# EAGLE design Display-Board_Rack-PDU_3.0 (EAGLE 9.6.2)
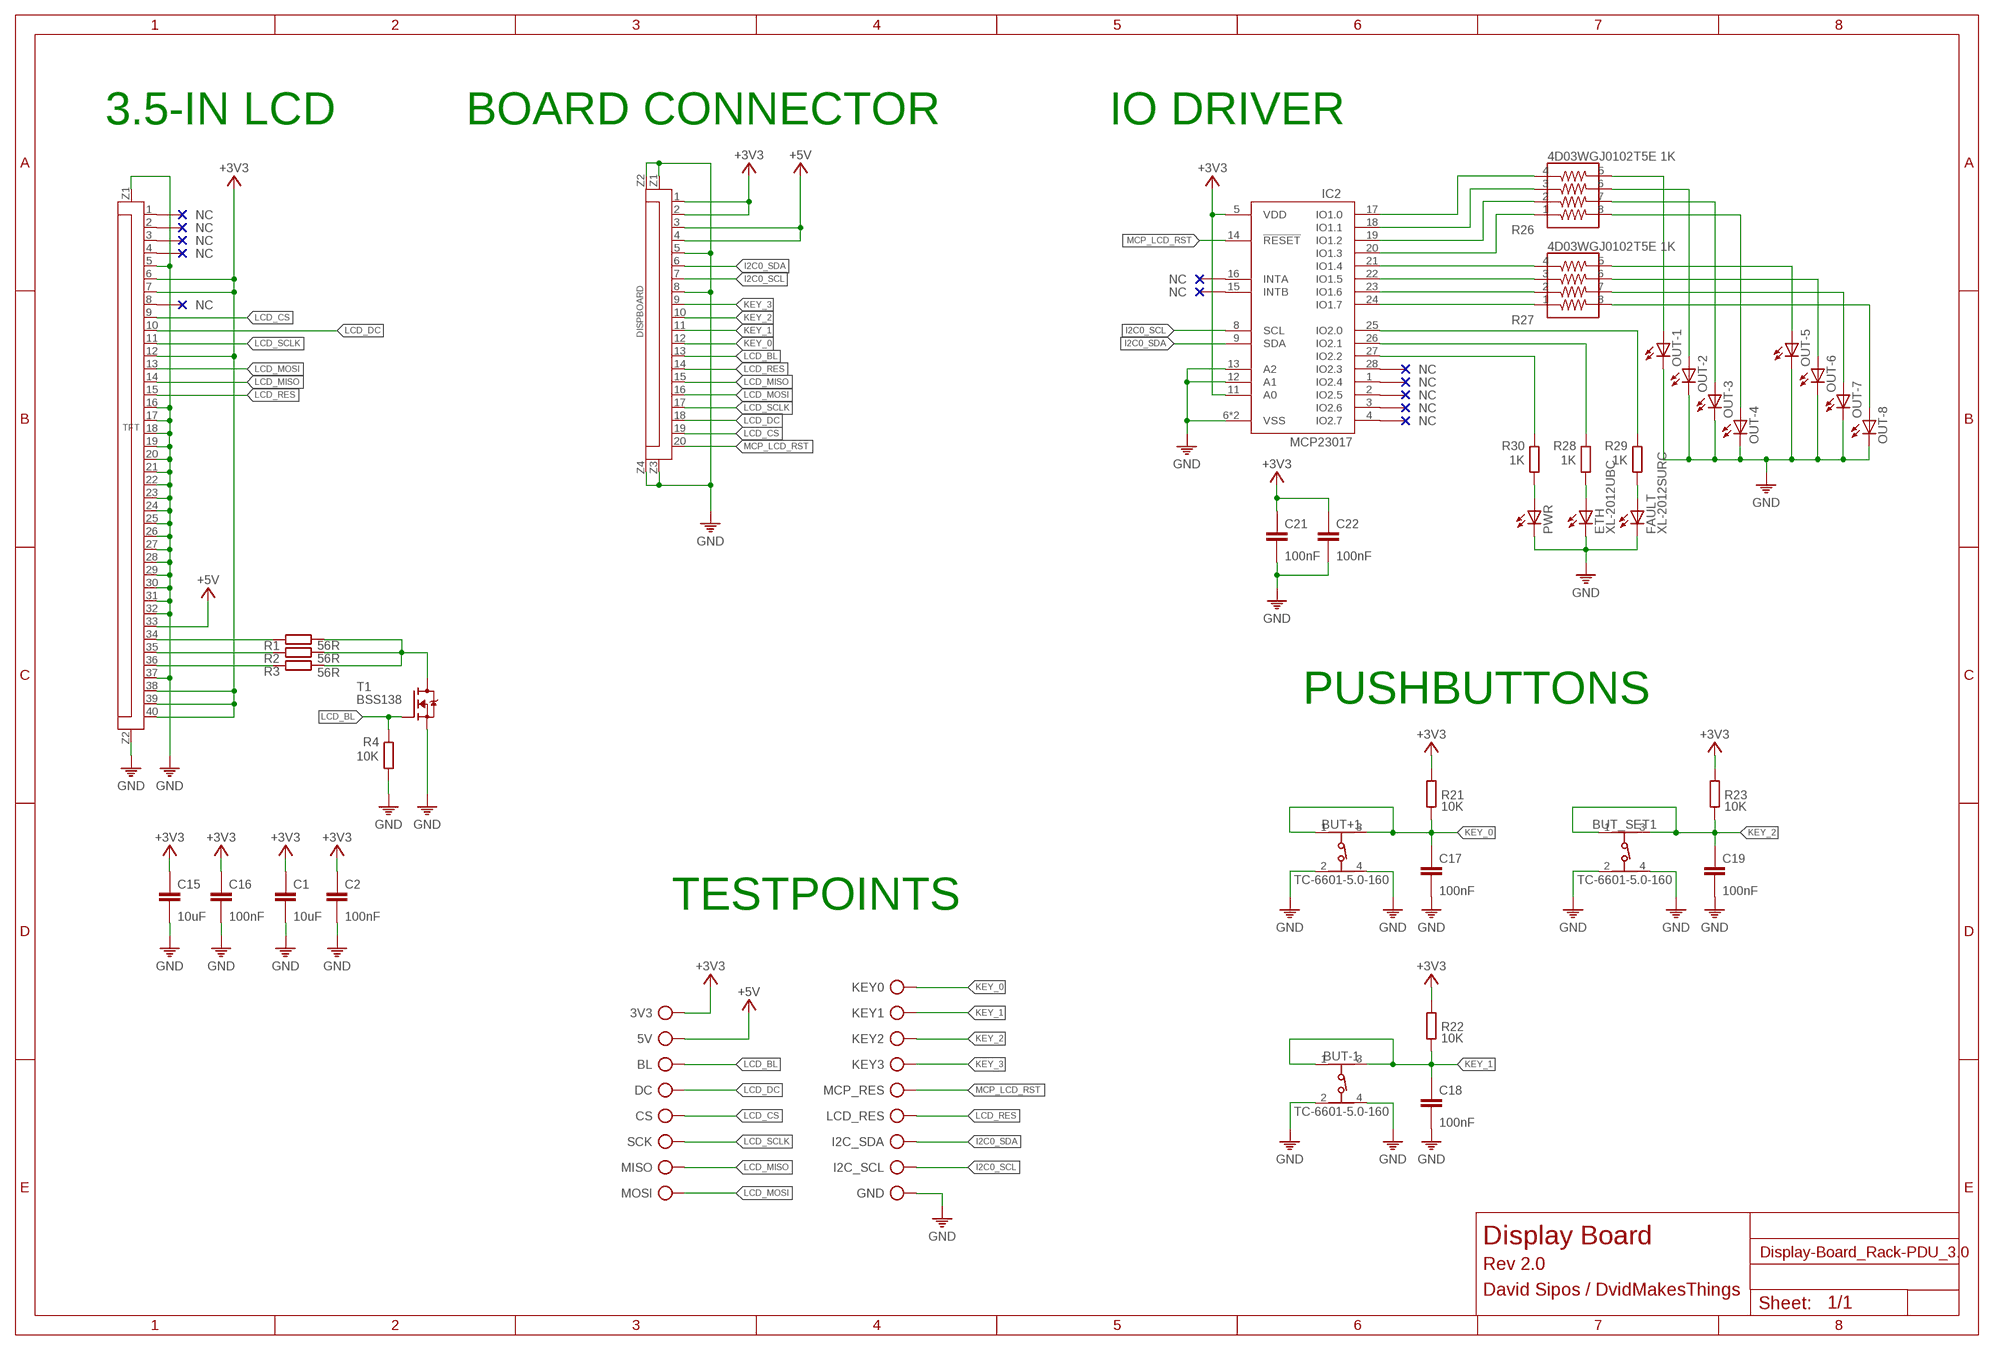
[diagram p0: schematic, sheet 1]

## Parts
3V3  TP  [TP]
5V  TP  [TP]
BL  TP  [TP]
BUT+1  TC-6601-5.0-160  430182043816  [430182043816]
BUT-1  TC-6601-5.0-160  430182043816  [430182043816]
BUT_SET1  TC-6601-5.0-160  430182043816  [430182043816]
C1  10uF  C-0402  [C0402]
C2  100nF  C-0402  [C0402]
C15  10uF  C-0402  [C0402]
C16  100nF  C-0402  [C0402]
C17  100nF  C-0402  [C0402]
C18  100nF  C-0402  [C0402]
C19  100nF  C-0402  [C0402]
C21  100nF  C-0402  [C0402]
C22  100nF  C-0402  [C0402]
CS  TP  [TP]
DC  TP  [TP]
DISPBOARD  FPC20-H  [FPC20]
ETH  XL-2012UBC  LEDCHIP-LED0805  [CHIP-LED0805]
FAULT  XL-2012SURC  LEDCHIP-LED0805  [CHIP-LED0805]
GND  TP  [TP]
I2C_SCL  TP  [TP]
I2C_SDA  TP  [TP]
IC2  MCP23017-E/ML  [QFN28[6X6]ML]
KEY0  TP  [TP]
KEY1  TP  [TP]
KEY2  TP  [TP]
KEY3  TP  [TP]
LCD_RES  TP  [TP]
MCP_RES  TP  [TP]
MISO  TP  [TP]
MOSI  TP  [TP]
OUT-1  LEDCHIP-LED0805  [CHIP-LED0805]
OUT-2  LEDCHIP-LED0805  [CHIP-LED0805]
OUT-3  LEDCHIP-LED0805  [CHIP-LED0805]
OUT-4  LEDCHIP-LED0805  [CHIP-LED0805]
OUT-5  LEDCHIP-LED0805  [CHIP-LED0805]
OUT-6  LEDCHIP-LED0805  [CHIP-LED0805]
OUT-7  LEDCHIP-LED0805  [CHIP-LED0805]
OUT-8  LEDCHIP-LED0805  [CHIP-LED0805]
PWR  LEDCHIP-LED0805  [CHIP-LED0805]
R1  56R  R0402  [0402]
R2  56R  R0402  [0402]
R3  56R  R0402  [0402]
R4  10K  R0402  [0402]
R21  10K  R0402  [0402]
R22  10K  R0402  [0402]
R23  10K  R0402  [0402]
R26  4D03WGJ0102T5E 1K  742C083103JP  [742C083103JP]
R27  4D03WGJ0102T5E 1K  742C083103JP  [742C083103JP]
R28  1K  R0402  [0402]
R29  1K  R0402  [0402]
R30  1K  R0402  [0402]
SCK  TP  [TP]
T1  BSS138  [SOT23]
TFT  FPC40-HD  [FPC40_3.5TFT]

## Nets
+3V3: 3V3.TP C1.1 C2.1 C15.1 C16.1 C21.1 C22.1 DISPBOARD.1 DISPBOARD.2 IC2.5(VDD) IC2.11(A0) R21.1 R22.1 R23.1 TFT.6 TFT.7 TFT.12 TFT.38 TFT.39 TFT.40
+5V: 5V.TP DISPBOARD.3 DISPBOARD.4 TFT.33
GND: BUT+1.2 BUT+1.4 BUT-1.2 BUT-1.4 BUT_SET1.2 BUT_SET1.4 C1.2 C2.2 C15.2 C16.2 C17.2 C18.2 C19.2 C21.2 C22.2 DISPBOARD.5 DISPBOARD.8 DISPBOARD.Z1 DISPBOARD.Z2 DISPBOARD.Z3 DISPBOARD.Z4 ETH.C FAULT.C GND.TP IC2.6(VSS) IC2.12(A1) IC2.13(A2) IC2.PAD(VSS) OUT-1.C OUT-2.C OUT-3.C OUT-4.C OUT-5.C OUT-6.C OUT-7.C OUT-8.C PWR.C R4.2 T1.2(S) TFT.5 TFT.16 TFT.17 TFT.18 TFT.19 TFT.20 TFT.21 TFT.22 TFT.23 TFT.24 TFT.25 TFT.26 TFT.27 TFT.28 TFT.29 TFT.30 TFT.31 TFT.32 TFT.37 TFT.Z1 TFT.Z2
I2C0_SCL: DISPBOARD.7 I2C_SCL.TP IC2.8(SCL)
I2C0_SDA: DISPBOARD.6 I2C_SDA.TP IC2.9(SDA)
KEY_0: BUT+1.1 BUT+1.3 C17.1 DISPBOARD.12 KEY0.TP R21.2
KEY_1: BUT-1.1 BUT-1.3 C18.1 DISPBOARD.11 KEY1.TP R22.2
KEY_2: BUT_SET1.1 BUT_SET1.3 C19.1 DISPBOARD.10 KEY2.TP R23.2
KEY_3: DISPBOARD.9 KEY3.TP
LCD_BL: BL.TP DISPBOARD.13 R4.1 T1.1(G)
LCD_CS: CS.TP DISPBOARD.19 TFT.9
LCD_DC: DC.TP DISPBOARD.18 TFT.10
LCD_MISO: DISPBOARD.15 MISO.TP TFT.14
LCD_MOSI: DISPBOARD.16 MOSI.TP TFT.13
LCD_RES: DISPBOARD.14 LCD_RES.TP TFT.15
LCD_SCLK: DISPBOARD.17 SCK.TP TFT.11
MCP_LCD_RST: DISPBOARD.20 IC2.14(!RESET) MCP_RES.TP
N$2: R2.2 TFT.35
N$3: R3.2 TFT.36
N$4: R1.1 R2.1 R3.1 T1.3(D)
N$5: R1.2 TFT.34
N$46: IC2.26(IO2.1) R28.1
N$47: IC2.27(IO2.2) R30.1
N$48: IC2.25(IO2.0) R29.1
N$50: IC2.17(IO1.0) R26.4
N$51: IC2.18(IO1.1) R26.3
N$52: IC2.19(IO1.2) R26.2
N$53: IC2.20(IO1.3) R26.1
N$54: IC2.21(IO1.4) R27.4
N$55: IC2.22(IO1.5) R27.3
N$56: IC2.23(IO1.6) R27.2
N$57: IC2.24(IO1.7) R27.1
N$58: OUT-1.A R26.5
N$59: OUT-2.A R26.6
N$60: OUT-3.A R26.7
N$61: OUT-4.A R26.8
N$62: OUT-5.A R27.5
N$63: OUT-6.A R27.6
N$64: OUT-7.A R27.7
N$65: OUT-8.A R27.8
N$66: FAULT.A R29.2
N$67: ETH.A R28.2
N$68: PWR.A R30.2
Unconnected: IC2.1(IO2.4) IC2.2(IO2.5) IC2.3(IO2.6) IC2.4(IO2.7) IC2.15(INTB) IC2.16(INTA) IC2.28(IO2.3) TFT.1 TFT.2 TFT.3 TFT.4 TFT.8

## Notes on the sheet
- 3.5-IN LCD | BOARD CONNECTOR | IO DRIVER
- PUSHBUTTONS
- TESTPOINTS
- Display Board
- Rev 2.0
- David Sipos / DvidMakesThings

## Library data of the parts
3V3 5V BL CS DC GND I2C_SCL I2C_SDA KEY0 KEY1-KEY3 LCD_RES MCP_RES MISO MOSI SCK = ds_passive:TP
BUT+1 BUT-1 BUT_SET1 = Wurth_Switch_WS-TASV:430182043816: WS-TASV SMT Tact Switch 6x6 mm Material Properties Cover Material : Stainless Steel Properties Actuator Material:LCP Actuator Flammability :UL94 V-0 Rating Actuator Color:Black; Salmon; White Frame Material:LCP Flammability Rating:UL94 V-0 Frame Color:Black Contact Material:Stainless Steel Contact Plating:Silver Terminal Material:Copper Alloy Terminal Plating:Silver VR:12 V (DC) Contact Resistance Initial:100 mΩ Contact Resistance After Life Test:2Ω RISO:100 MΩ Withstanding Voltage:250 V (AC) Washable:No Qty.:4000;5000 Mechanical Properties Electrical Life:400; 550; 1000 Stroke :0.25 mm General Information Operating Temperature:-40 up to +85 °C Washable:No Packaging Properties Packaging:Tape and Reel <https://www.we-online.com/catalog/media/o37470v209%20Family_WS-TASV_6x6mm_SMD_Tact_Switch_4301820xx8xx.jpg> Details see: https://www.we-online.com/catalog/en/TASV_6X6_SMD/ Updated by yingchun,Shan;2020-02-18 2020(C) Würth Elektronik; DATASHEET-URL: https://www.we-online.com/redexpert/spec/430182043816?ae; HEIGHT: 4.3mm; OPERATION-FORCE: 160g; PART-NUMBER: 430182043816; QTY: 1000; VALUE: 430182043816
C1 C2 C15-C19 C21 C22 = ds_passive:C
DISPBOARD = ds_con:FPC20-H
ETH FAULT OUT-1-OUT-8 PWR = led:LED: LED OSRAM: - CHIPLED LG R971, LG N971, LY N971, LG Q971, LY Q971, LO R971, LY R971 LH N974, LH R974 LS Q976, LO Q976, LY Q976 LO Q996 - Hyper CHIPLED LW Q18S LB Q993, LB Q99A, LB R99A - SideLED LS A670, LO A670, LY A670, LG A670, LP A670 LB A673, LV A673, LT A673, LW A673 LH A674 LY A675 LS A676, LA A676, LO A676, LY A676, LW A676 LS A679, LY A679, LG A679 - Hyper Micro SIDELED® LS Y876, LA Y876, LO Y876, LY Y876 LT Y87S - SmartLED LW L88C, LW L88S LB L89C, LB L89S, LG L890 LS L89K, LO L89K, LY L89K LS L896, LA L896, LO L896, LY L896 - TOPLED LS T670, LO T670, LY T670, LG T670, LP T670 LSG T670, LSP T670, LSY T670, LOP T670, LYG T670 LG T671, LOG T671, LSG T671 LB T673, LV T673, LT T673, LW T673 LH T674 LS T676, LA T676, LO T676, LY T676, LB T676, LH T676, LSB T676, LW T676 LB T67C, LV T67C, LT T67C, LS T67K, LO T67K, LY T67K, LW E67C LS E67B, LA E67B, LO E67B, LY E67B, LB E67C, LV E67C, LT E67C LW T67C LS T679, LY T679, LG T679 LS T770, LO T770, LY T770, LG T770, LP T770 LB T773, LV T773, LT T773, LW T773 LH T774 LS E675, LA E675, LY E675, LS T675 LS T776, LA T776, LO T776, LY T776, LB T776 LHGB T686 LT T68C, LB T68C - Hyper Mini TOPLED® LB M676 - Mini TOPLED Santana® LG M470 LS M47K, LO M47K, LY M47K Source: http://www.osram.convergy.de LUXEON: - LUMILED® LXK2-PW12-R00, LXK2-PW12-S00, LXK2-PW14-U00, LXK2-PW14-V00 LXK2-PM12-R00, LXK2-PM12-S00, LXK2-PM14-U00 LXK2-PE12-Q00, LXK2-PE12-R00, LXK2-PE12-S00, LXK2-PE14-T00, LXK2-PE14-U00 LXK2-PB12-K00, LXK2-PB12-L00, LXK2-PB12-M00, LXK2-PB14-N00, LXK2-PB14-P00, LXK2-PB14-Q00 LXK2-PR12-L00, LXK2-PR12-M00, LXK2-PR14-Q00, LXK2-PR14-R00 LXK2-PD12-Q00, LXK2-PD12-R00, LXK2-PD12-S00 LXK2-PH12-R00, LXK2-PH12-S00 LXK2-PL12-P00, LXK2-PL12-Q00, LXK2-PL12-R00 Source: www.luxeon.com KINGBRIGHT: KA-3528ASYC Source: www.kingbright.com
IC2 = ds_ic_peripherals:MCP23017: 16-Bit I2C I/O Expander with Serial Interface
R1-R4 R21-R23 R28-R30 = ds_passive:R
R26 R27 = Resistor Array:742C083103JP: RES ARRAY 4 RES 10K OHM 1206 Manufacturer's datasheet <https://www.ctscorp.com/wp-content/uploads/74x.pdf>; CREATED_BY: PCBLayout.com; DIGIKEY_PN: 742C083103JPTR-ND; MANUFACTURER: CTS Resistor Products; MPN: 742C083103JP; PACKAGE: 1206
T1 = transistor-fet:BSS138: N-Channel Logic Level Enhancement Mode Field Effect Transistor
TFT = ds_con:FPC40-H

## Net classes
0 default: width 0.2 mm, drill 0.35 mm, clearance 0.191 mm

## Board
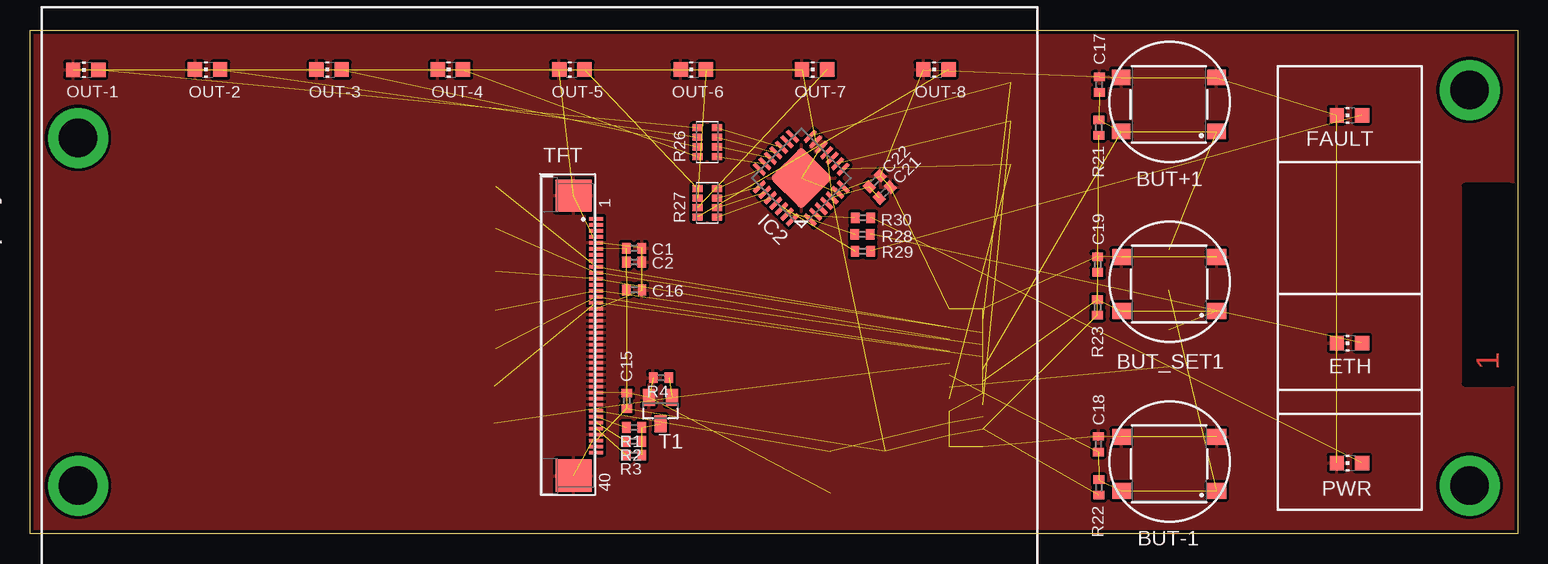
[diagram p1: board, top side]
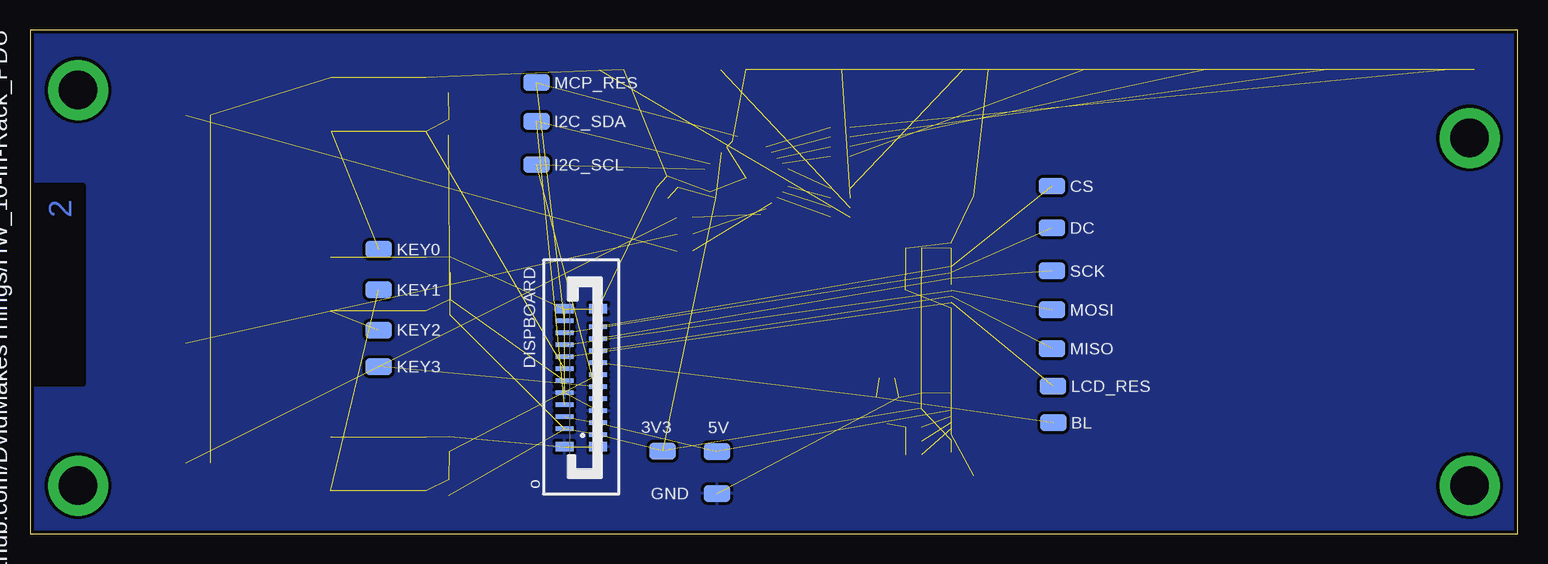
[diagram p2: board, bottom side, seen from below]

Size 124 x 42 mm. Coordinates in mm from the lower left corner, seen from the top.
Outline: 0,0 0,42 124,42 124,0 0,0
Copper layers (1*16): Top 0.035mm / dielectric 1.6mm / Bottom 0.035mm
Design rules "jlcpcb-2layers": minimum track width 5mil, minimum drill 0.3mm, track to track 5mil, track to pad 5mil, pad to pad 5mil, via to via 5mil, smd to smd 5mil, copper to edge 0.2mm, drill to drill 6mil, minimum pad ring 10mil, minimum via ring 3mil, stop-mask expansion 4mil, vias tented up to drill 0mil, thermal gap 10mil

### Footprints (pad centres in the part's own frame; a part is rotated, then mirrored left to right if it is on the bottom)
TP = smd 2.2 x 1.4: TP 0,0
430182043816 = smd 1.55 x 1.3: 1 -3.975,2.25; 2 -3.975,-2.25; 3 3.975,2.25; 4 3.975,-2.25
C0402 = smd 0.7 x 0.9: 1 -0.65,0; 2 0.65,0
FPC20 = smd 0.4 x 1.5: 1 -4.552,-1.362; 2 -4.052,1.438; 3 -3.552,-1.362; 4 -3.052,1.438; 5 -2.552,-1.362; 6 -2.052,1.438; 7 -1.552,-1.362; 8 -1.052,1.438; 9 -0.552,-1.362; 10 -0.052,1.438; 11 0.448,-1.362; 12 0.948,1.438; 13 1.448,-1.362; 14 1.948,1.438; 15 2.448,-1.362; 16 2.948,1.438; 17 3.448,-1.362; 18 3.948,1.438; 19 4.448,-1.362; 20 4.948,1.438 | smd 0.8 x 1.5: Z1 -5.552,-1.362; Z2 -5.552,1.438; Z3 5.948,-1.362; Z4 5.948,1.438
CHIP-LED0805 = smd 1.2 x 1.2: A 0,-1.05; C 0,1.05
QFN28[6X6]ML = smd 1.27 x 0.35: 1 -2.985,1.95; 2 -2.985,1.3; 3 -2.985,0.65; 4 -2.985,0; 5 -2.985,-0.65; 6 -2.985,-1.3; 7 -2.985,-1.95; 15 2.985,-1.95; 16 2.985,-1.3; 17 2.985,-0.65; 18 2.985,0; 19 2.985,0.65; 20 2.985,1.3; 21 2.985,1.95 | smd 0.35 x 1.27: 8 -1.95,-2.985; 9 -1.3,-2.985; 10 -0.65,-2.985; 11 0,-2.985; 12 0.65,-2.985; 13 1.3,-2.985; 14 1.95,-2.985; 22 1.95,2.985; 23 1.3,2.985; 24 0.65,2.985; 25 0,2.985; 26 -0.65,2.985; 27 -1.3,2.985; 28 -1.95,2.985 | smd 3.7 x 3.7: PAD 0,0
0402 = smd 0.7 x 0.9: 1 -0.65,0; 2 0.65,0
742C083103JP = smd 0.59 x 0.92: 1 -1.2,-0.8; 2 -0.4,-0.8; 3 0.4,-0.8; 4 1.2,-0.8; 5 1.2,0.8; 6 0.4,0.8; 7 -0.4,0.8; 8 -1.2,0.8
SOT23 = smd 1 x 1.4: 1 -0.95,-1.1; 2 0.95,-1.1; 3 0,1.1
FPC40_3.5TFT = smd 1.2 x 0.3: 1 24.191,10.261; 2 24.191,9.761; 3 24.191,9.261; 4 24.191,8.761; 5 24.191,8.261; 6 24.191,7.761; 7 24.191,7.261; 8 24.191,6.761; 9 24.191,6.261; 10 24.191,5.761; 11 24.191,5.261; 12 24.191,4.761; 13 24.191,4.261; 14 24.191,3.761; 15 24.191,3.261; 16 24.191,2.761; 17 24.191,2.261; 18 24.191,1.761; 19 24.191,1.261; 20 24.191,0.761; 21 24.191,0.261; 22 24.191,-0.239; 23 24.191,-0.739; 24 24.191,-1.239; 25 24.191,-1.739; 26 24.191,-2.239; 27 24.191,-2.739; 28 24.191,-3.239; 29 24.191,-3.739; 30 24.191,-4.239; 31 24.191,-4.739; 32 24.191,-5.239; 33 24.191,-5.739; 34 24.191,-6.239; 35 24.191,-6.739; 36 24.191,-7.239; 37 24.191,-7.739; 38 24.191,-8.239; 39 24.191,-8.739; 40 24.191,-9.239 | smd 3 x 2.7: Z1 22.331,12.191; Z2 22.331,-11.169

### Placement (x,y rotation side)
3V3  71.26,6.88 180 bottom
5V  66.74,6.85 0 bottom
BL  38.7,9.25 0 bottom
BUT+1  94.94,35.79 180 top
BUT-1  94.96,5.81 180 top
BUT_SET1  94.96,20.81 180 top
C1  50.35,23.8 0 top
C2  50.35,22.65 0 top
C15  49.75,11.07 90 top
C16  50.37,20.32 0 top
C17  89.14,37.44 90 top
C18  89.06,7.46 90 top
C19  89,22.44 90 top
C21  71.26,28.44 45 top
C22  70.42,29.37 45 top
CS  38.8,28.98 0 bottom
DC  38.8,25.5 0 bottom
DISPBOARD  78,12.8 90 bottom
ETH  109.99,15.88 90 top
FAULT  109.99,34.88 90 top
GND  66.74,3.35 0 bottom
I2C_SCL  81.79,30.77 0 bottom
I2C_SDA  81.79,34.39 0 bottom
IC2  64.29,29.65 135 top
KEY0  94.92,23.7 0 bottom
KEY1  94.92,20.33 0 bottom
KEY2  94.92,16.96 0 bottom
KEY3  94.92,13.93 0 bottom
LCD_RES  38.71,12.3 0 bottom
MCP_RES  81.79,37.61 0 bottom
MISO  38.8,15.43 0 bottom
MOSI  38.8,18.66 0 bottom
OUT-1  4.65,38.68 90 top
OUT-2  14.81,38.7 90 top
OUT-3  24.93,38.7 90 top
OUT-4  35.05,38.7 90 top
OUT-5  45.17,38.7 90 top
OUT-6  55.29,38.7 90 top
OUT-7  65.41,38.7 90 top
OUT-8  75.53,38.7 90 top
PWR  109.99,5.88 90 top
R1  50.35,8.85 180 top
R2  50.35,7.7 180 top
R3  50.35,6.55 180 top
R4  52.6,13 180 top
R21  89.1,33.86 90 top
R22  89.1,3.84 90 top
R23  88.99,18.86 90 top
R26  56.46,32.65 90 top
R27  56.46,27.59 90 top
R28  69.4,24.96 0 top
R29  69.42,23.55 0 top
R30  69.44,26.34 0 top
SCK  38.8,21.9 0 bottom
T1  52.55,10.25 180 top
TFT  23,16 0 top
U$1  [2-LAYER]  123.4,12.5 90 top

### Tracks (layer width: path | path; a pad name or v marks a point on that pad's centre or on a via)
+3V3  (19 unrouted)
+5V  (3 unrouted)
GND  (59 unrouted)
  pour Bottom (isolate 0.254): -18.8,59.02 131.7,59.02 131.7,-17.78 -18.8,-17.78
  pour Top (isolate 0.254): -19.5,57.22 131.15,57.22 131.15,-16.18 -19.5,-16.18
I2C0_SCL  (2 unrouted)
I2C0_SDA  (2 unrouted)
KEY_0  (5 unrouted)
KEY_1  (5 unrouted)
KEY_2  (5 unrouted)
KEY_3  (1 unrouted)
LCD_BL  (3 unrouted)
LCD_CS  (2 unrouted)
LCD_DC  (2 unrouted)
LCD_MISO  (2 unrouted)
LCD_MOSI  (2 unrouted)
LCD_RES  (2 unrouted)
LCD_SCLK  (2 unrouted)
MCP_LCD_RST  (2 unrouted)
N$1  (via drill 3.2 pad 5)
  other vias: 4,4
N$2  (1 unrouted)
N$3  (1 unrouted)
N$4  (3 unrouted)
N$5  (1 unrouted)
N$6  (via drill 3.2 pad 5)
  other vias: 4,33
N$7  (via drill 3.2 pad 5)
  other vias: 120,37
N$8  (via drill 3.2 pad 5)
  other vias: 120,4
N$46  (1 unrouted)
N$47  (1 unrouted)
N$48  (1 unrouted)
N$50  (1 unrouted)
N$51  (1 unrouted)
N$52  (1 unrouted)
N$53  (1 unrouted)
N$54  (1 unrouted)
N$55  (1 unrouted)
N$56  (1 unrouted)
N$57  (1 unrouted)
N$58  (1 unrouted)
N$59  (1 unrouted)
N$60  (1 unrouted)
N$61  (1 unrouted)
N$62  (1 unrouted)
N$63  (1 unrouted)
N$64  (1 unrouted)
N$65  (1 unrouted)
N$66  (1 unrouted)
N$67  (1 unrouted)
N$68  (1 unrouted)

### Text on the board
tPlace: Display Board REV3.0
bPlace: github.com/DvidMakesThings/HW_10-In-Rack_PDU
bNames: o